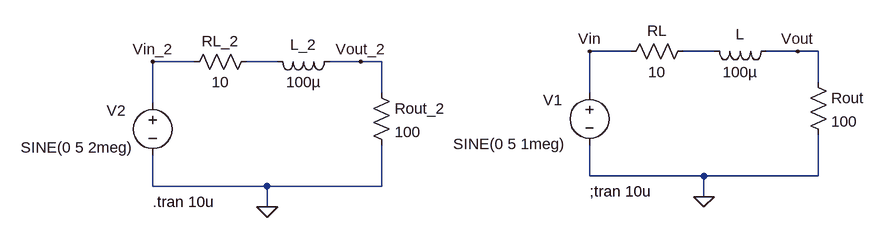
[diagram p0: schematic SoftwareLab1_2.asc]
SoftwareLab1_2.asc, the LTspice schematic file:
Version 4
SHEET 1 880 680
WIRE 112 64 48 64
WIRE 240 64 192 64
WIRE 368 64 320 64
WIRE 400 64 368 64
WIRE -560 80 -624 80
WIRE -432 80 -480 80
WIRE -304 80 -352 80
WIRE -272 80 -304 80
WIRE 400 112 400 64
WIRE -272 128 -272 80
WIRE 48 128 48 64
WIRE -624 144 -624 80
WIRE 48 256 48 208
WIRE 224 256 48 256
WIRE 400 256 400 192
WIRE 400 256 224 256
WIRE -624 272 -624 224
WIRE -448 272 -624 272
WIRE -272 272 -272 208
WIRE -272 272 -448 272
WIRE 224 288 224 256
WIRE -448 304 -448 272
FLAG 224 288 0
FLAG 48 64 Vin
FLAG 368 64 Vout
FLAG -448 304 0
FLAG -624 80 Vin_2
FLAG -304 80 Vout_2
SYMBOL res 208 48 R90
WINDOW 0 0 56 VBottom 2
WINDOW 3 32 56 VTop 2
SYMATTR InstName RL
SYMATTR Value 10
SYMBOL ind 336 48 R90
WINDOW 0 5 56 VBottom 2
WINDOW 3 32 56 VTop 2
SYMATTR InstName L
SYMATTR Value 100µ
SYMBOL voltage 48 112 R0
WINDOW 0 -71 27 Left 2
WINDOW 3 -210 95 Left 2
WINDOW 123 0 0 Left 2
WINDOW 39 0 0 Left 2
SYMATTR InstName V1
SYMATTR Value SINE(0 5 1meg)
SYMBOL res 384 96 R0
SYMATTR InstName Rout
SYMATTR Value 100
SYMBOL res -464 64 R90
WINDOW 0 0 56 VBottom 2
WINDOW 3 32 56 VTop 2
SYMATTR InstName RL_2
SYMATTR Value 10
SYMBOL ind -336 64 R90
WINDOW 0 5 56 VBottom 2
WINDOW 3 32 56 VTop 2
SYMATTR InstName L_2
SYMATTR Value 100µ
SYMBOL voltage -624 128 R0
WINDOW 0 -71 27 Left 2
WINDOW 3 -203 84 Left 2
WINDOW 123 0 0 Left 2
WINDOW 39 0 0 Left 2
SYMATTR InstName V2
SYMATTR Value SINE(0 5 2meg)
SYMBOL res -288 112 R0
SYMATTR InstName Rout_2
SYMATTR Value 100
TEXT 48 280 Left 2 !;tran 10u
TEXT -624 296 Left 2 !.tran 10u

The netlist it stands for:
* SoftwareLab1_2.asc
RL N001 Vin 10
L Vout N001 100µ
V1 Vin 0 SINE(0 5 1meg)
Rout Vout 0 100
RL_2 N002 Vin_2 10
L_2 Vout_2 N002 100µ
V2 Vin_2 0 SINE(0 5 2meg)
Rout_2 Vout_2 0 100
;tran 10u
.tran 10u
.backanno
.end

* Results of the author's LTspice run, read from the files saved beside the schematic
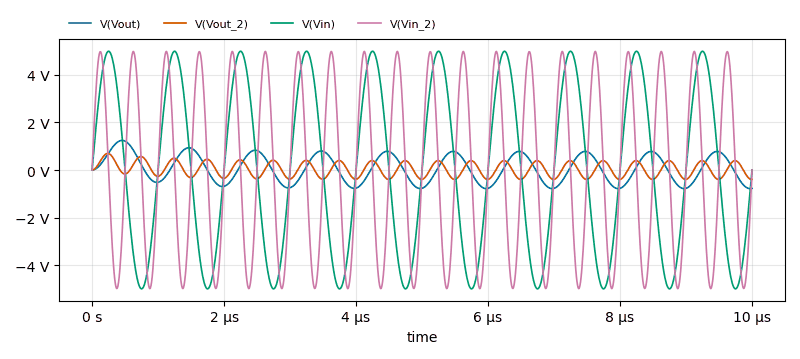
[diagram p1: Transient Analysis of SoftwareLab1_2.asc, plotted from the saved traces]
* Transient Analysis, 1 run:
*   V(Vout): min -782.8 mV, max 1.246 V, average 70.17 mV, rms 577.5 mV, last -771.9 mV
*   V(Vout_2): min -394.7 mV, max 697.1 mV, average 35.85 mV, rms 291.3 mV, last -394.4 mV
*   V(Vin): min -4.995 V, max 4.995 V, average -2.126 µV, rms 3.532 V, last 0 V
*   V(Vin_2): min -4.988 V, max 4.988 V, average -6.662 µV, rms 3.523 V, last 0 V